# EAGLE schematic Board (EAGLE 9.2.2)
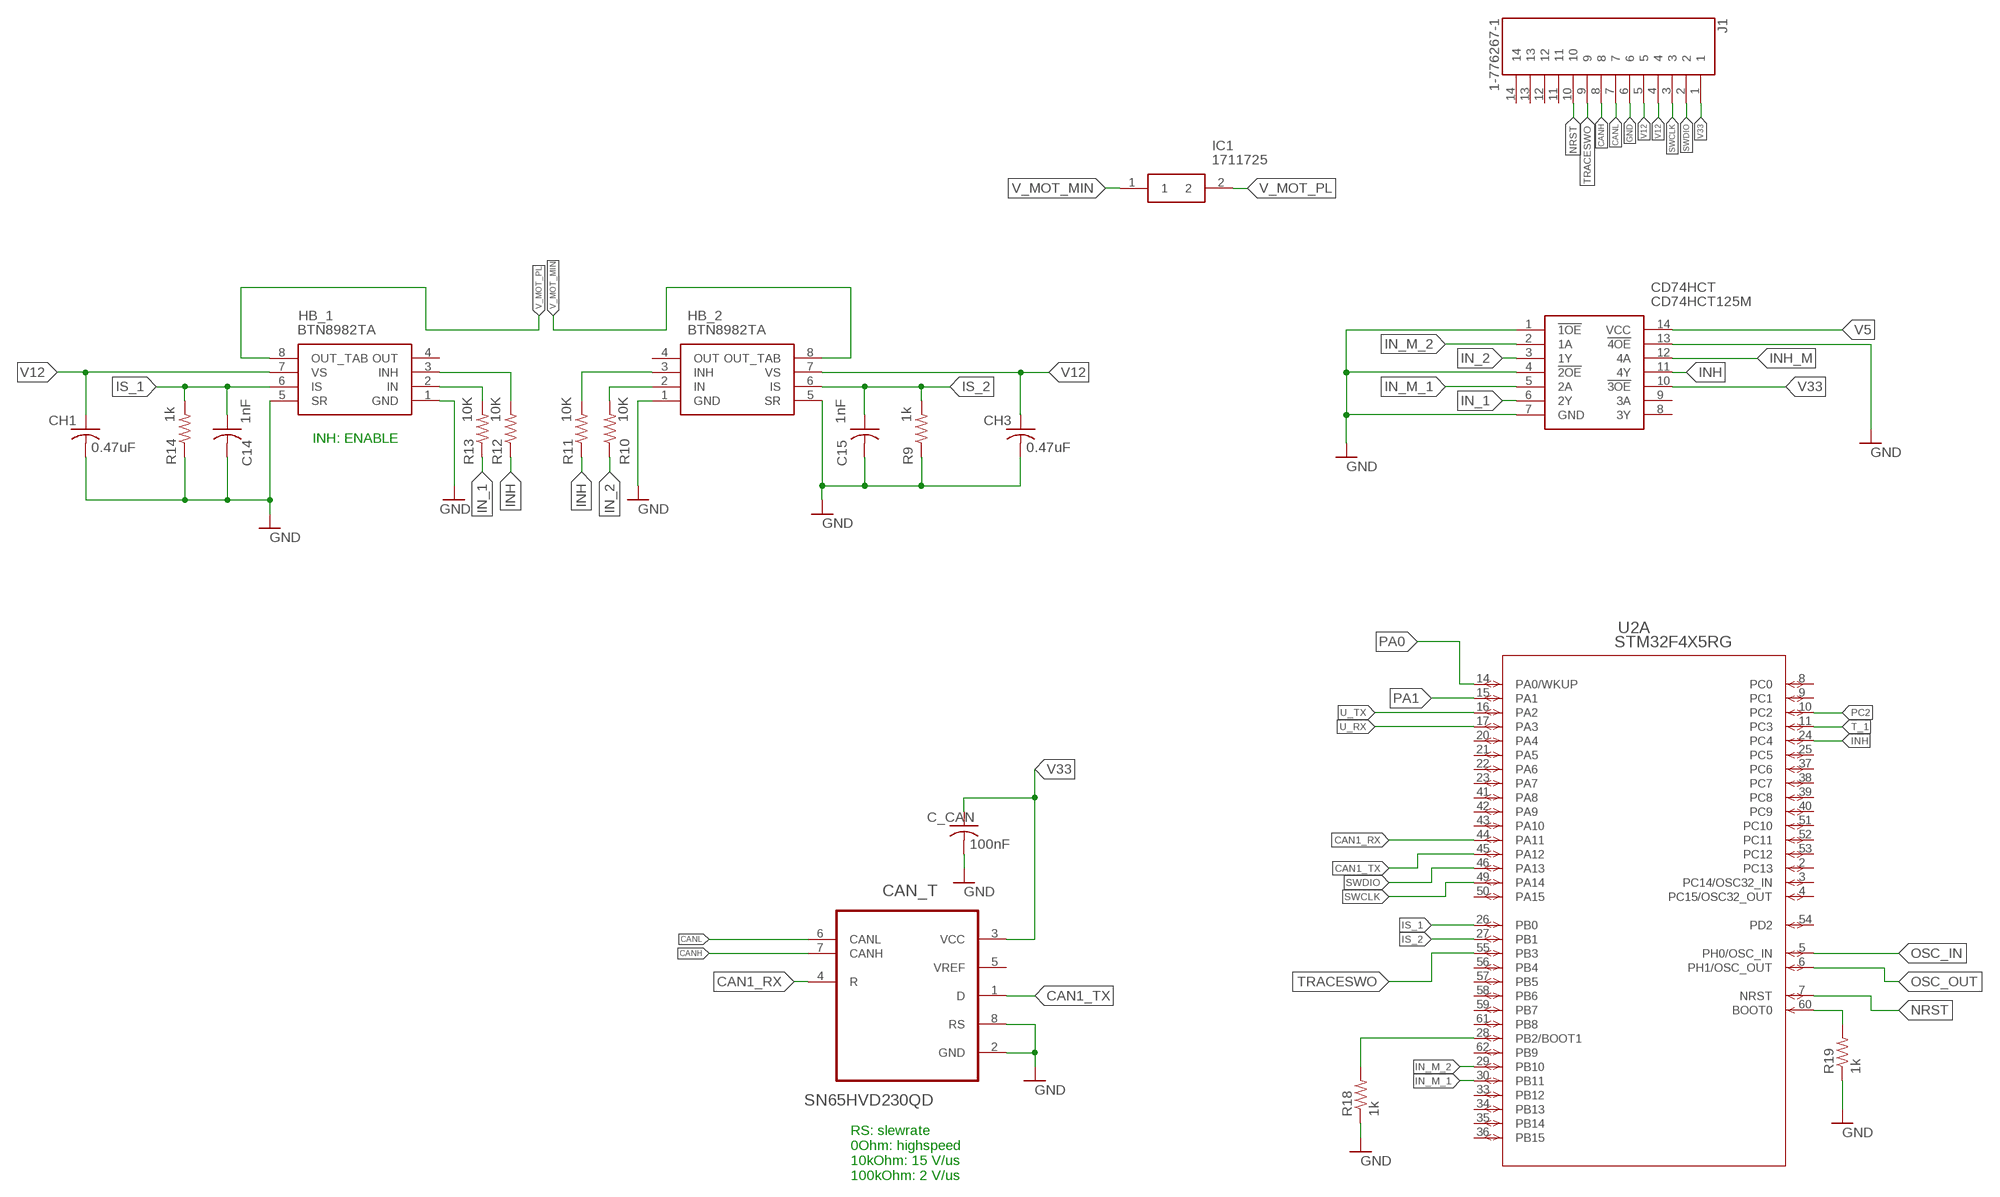
[diagram p0: schematic, sheet 1, part 1 of 2]
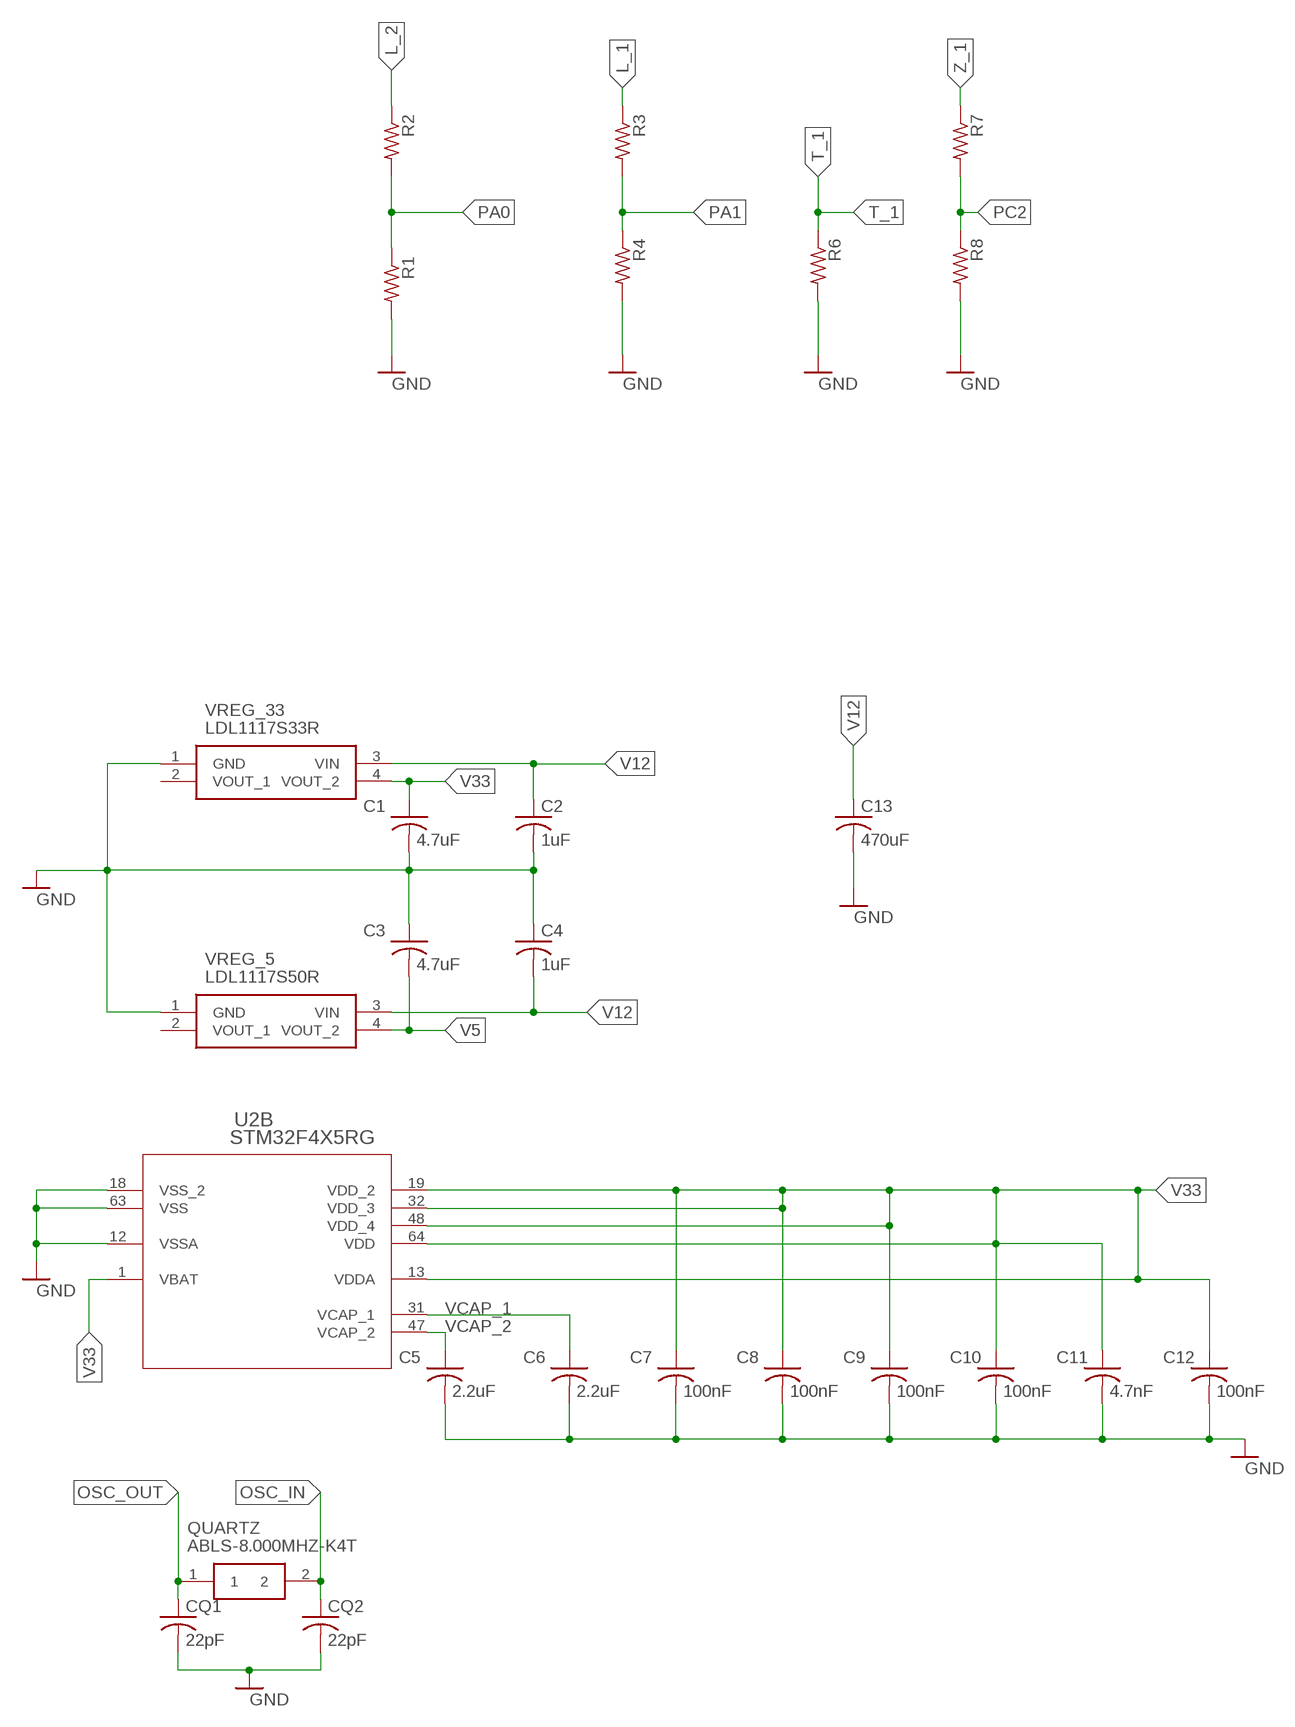
[diagram p1: schematic, sheet 1, part 2 of 2]

## Parts
C1  4.7uF  C-USC1206  [C1206]
C2  1uF  C-USC1206  [C1206]
C3  4.7uF  C-USC1206  [C1206]
C4  1uF  C-USC1206  [C1206]
C5  2.2uF  C-USC1206  [C1206]
C6  2.2uF  C-USC1206  [C1206]
C7  100nF  C-USC1206  [C1206]
C8  100nF  C-USC1206  [C1206]
C9  100nF  C-USC1206  [C1206]
C10  100nF  C-USC1206  [C1206]
C11  4.7nF  C-USC1206  [C1206]
C12  100nF  C-USC1206  [C1206]
C13  470uF  C-US050-075X075  [C050-075X075]
C14  1nF  C-USC1206  [C1206]
C15  1nF  C-USC1206  [C1206]
C_CAN  100nF  C-USC1206  [C1206]
CAN_T  SN65HVD230QD  [SOIC127P600X175-8N]
CD74HCT  CD74HCT125M  [SOIC127P600X175-14N]
CH1  0.47uF  C-USC1206  [C1206]
CH3  0.47uF  C-USC1206  [C1206]
CQ1  22pF  C-USC0805  [C0805]
CQ2  22pF  C-USC0805  [C0805]
HB_1  BTN8982TA  [TO127P1500X440-8N]
HB_2  BTN8982TA  [TO127P1500X440-8N]
IC1  1711725  [PHEONIX-5.08PITCH-2PIN]
J1  1-776267-1  [TE_1-776267-1]
QUARTZ  ABLS-8.000MHZ-K4T  [ABLS-12.000MHZ-B2]
R1  R-US_R1206  [R1206]
R2  R-US_R1206  [R1206]
R3  R-US_R1206  [R1206]
R4  R-US_R1206  [R1206]
R6  R-US_R1206  [R1206]
R7  R-US_R1206  [R1206]
R8  R-US_R1206  [R1206]
R9  1k  R-US_R1206  [R1206]
R10  10K  R-US_R1206  [R1206]
R11  10K  R-US_R1206  [R1206]
R12  10K  R-US_R1206  [R1206]
R13  10K  R-US_R1206  [R1206]
R14  1k  R-US_R1206  [R1206]
R18  1k  R-US_R1206  [R1206]
R19  1k  R-US_R1206  [R1206]
U2  STM32F4X5RG  [LQFP64-10X10MM]
VREG_5  LDL1117S50R  [SOT230P700X180-4N]
VREG_33  LDL1117S33R  [SOT230P700X180-4N]

## Nets
BOOT0: R19.2 U2.60(A:BOOT0)
BOOT1: R18.2 U2.28(A:PB2/BOOT1)
CAN1_RX: CAN_T.4(R) U2.44(A:PA11)
CAN1_TX: CAN_T.1(D) U2.45(A:PA12)
CANH: CAN_T.7(CANH) J1.8
CANL: CAN_T.6(CANL) J1.7
GND: C1.2 C2.2 C3.1 C4.1 C5.2 C6.2 C7.2 C8.2 C9.2 C10.2 C11.2 C12.2 C13.2 C14.2 C15.2 C_CAN.2 CAN_T.2(GND) CAN_T.8(RS) CD74HCT.1(!1OE) CD74HCT.4(!2OE) CD74HCT.7(GND) CD74HCT.13(!4OE) CH1.2 CH3.2 CQ1.2 CQ2.2 HB_1.1(GND) HB_1.5(SR) HB_2.1(GND) HB_2.5(SR) J1.6 R1.2 R4.2 R6.2 R8.2 R9.1 R14.1 R18.1 R19.1 U2.12(B:VSSA) U2.18(B:VSS_2) U2.63(B:VSS) VREG_5.1(GND) VREG_33.1(GND)
HB1_IN: HB_1.2(IN) R13.2
HB1_INH: HB_1.3(INH) R12.2
HB2_IN: HB_2.2(IN) R10.2
HB2_INH: HB_2.3(INH) R11.2
IN_1: CD74HCT.6(2Y) R13.1
IN_2: CD74HCT.3(1Y) R10.1
IN_M_1: CD74HCT.5(2A) U2.30(A:PB11)
IN_M_2: CD74HCT.2(1A) U2.29(A:PB10)
INH: CD74HCT.11(4Y) R11.1 R12.1 U2.24(A:PC4)
INH_M: CD74HCT.12(4A)
IS_1: C14.1 HB_1.6(IS) R14.2 U2.26(A:PB0)
IS_2: C15.1 HB_2.6(IS) R9.2 U2.27(A:PB1)
L_1: R3.1
L_2: R2.1
NRST: J1.10 U2.7(A:NRST)
OSC_IN: CQ2.1 QUARTZ.2 U2.5(A:PH0/OSC_IN)
OSC_OUT: CQ1.1 QUARTZ.1 U2.6(A:PH1/OSC_OUT)
PA0: R1.1 R2.2 U2.14(A:PA0/WKUP)
PA1: R3.2 R4.1 U2.15(A:PA1)
PC2: R7.2 R8.1 U2.10(A:PC2)
SWCLK: J1.3 U2.49(A:PA14)
SWDIO: J1.2 U2.46(A:PA13)
T_1: R6.1 U2.11(A:PC3)
TRACESWO: J1.9 U2.55(A:PB3)
U_RX: U2.17(A:PA3)
U_TX: U2.16(A:PA2)
V5: C3.2 CD74HCT.14(VCC) VREG_5.4(VOUT_2)
V12: C2.1 C4.2 C13.1 CH1.1 CH3.1 HB_1.7(VS) HB_2.7(VS) J1.4 J1.5 VREG_5.3(VIN) VREG_33.3(VIN)
V33: C1.1 C7.1 C8.1 C9.1 C10.1 C11.1 C12.1 C_CAN.1 CAN_T.3(VCC) CD74HCT.10(!3OE) J1.1 U2.1(B:VBAT) U2.13(B:VDDA) U2.19(B:VDD_2) U2.32(B:VDD_3) U2.48(B:VDD_4) U2.64(B:VDD) VREG_33.4(VOUT_2)
V_MOT_MIN: HB_2.8(OUT_TAB) IC1.1
V_MOT_PL: HB_1.8(OUT_TAB) IC1.2
VCAP_1: C6.1 U2.31(B:VCAP_1)
VCAP_2: C5.1 U2.47(B:VCAP_2)
Z_1: R7.1
Unconnected: CAN_T.5(VREF) CD74HCT.8(3Y) CD74HCT.9(3A) HB_1.4(OUT) HB_2.4(OUT) J1.11 J1.12 J1.13 J1.14 U2.2(A:PC13) U2.3(A:PC14/OSC32_IN) U2.4(A:PC15/OSC32_OUT) U2.8(A:PC0) U2.9(A:PC1) U2.20(A:PA4) U2.21(A:PA5) U2.22(A:PA6) U2.23(A:PA7) U2.25(A:PC5) U2.33(A:PB12) U2.34(A:PB13) U2.35(A:PB14) U2.36(A:PB15) U2.37(A:PC6) U2.38(A:PC7) U2.39(A:PC8) U2.40(A:PC9) U2.41(A:PA8) U2.42(A:PA9) U2.43(A:PA10) U2.50(A:PA15) U2.51(A:PC10) U2.52(A:PC11) U2.53(A:PC12) U2.54(A:PD2) U2.56(A:PB4) U2.57(A:PB5) U2.58(A:PB6) U2.59(A:PB7) U2.61(A:PB8) U2.62(A:PB9) VREG_5.2(VOUT_1) VREG_33.2(VOUT_1)

## Notes on the sheet
- INH: ENABLE
- RS: slewrate
  0Ohm: highspeed
  10kOhm: 15 V/us
  100kOhm: 2 V/us

## Library data of the parts
C1-C15 C_CAN CH1 CH3 CQ1 CQ2 = adafruit:C-US: CAPACITOR, American symbol
CAN_T = ADP_Components:SN65HVD230QD: 3.3-V CAN TRANSCEIVERS; MF: TEXAS INSTRUMENTS; MPN: SN65HVD230QD..; OC_FARNELL: 1648752; OC_NEWARK: 75C7746; PACKAGE: SOIC-8; SUPPLIER: Texas Instruments
CD74HCT = SamacSys_Parts:CD74HCT125M: High Speed CMOS Logic Quad Buffers with 3-State Outputs Source: Datasheet <http://www.ti.com/lit/ds/symlink/cd74hct125.pdf>; DESCRIPTION: High Speed CMOS Logic Quad Buffers with 3-State Outputs; HEIGHT: 1.75mm; MANUFACTURER_NAME: Texas Instruments; MANUFACTURER_PART_NUMBER: CD74HCT125M; MOUSER_PART_NUMBER: 595-CD74HCT125M
HB_1 HB_2 = SamacSys_Parts:BTN8982TA: New Infineon BTN8982TA Motor Driver,, 7-Pin TO-263-7-1 Source: Datasheet <http://www.mouser.com/datasheet/2/196/Infineon-BTN8982TA-DS-v01_00-EN-786008.pdf>; DESCRIPTION: New Infineon BTN8982TA Motor Driver,, 7-Pin TO-263-7-1; HEIGHT: 4.4mm; MANUFACTURER_NAME: Infineon; MANUFACTURER_PART_NUMBER: BTN8982TA; MOUSER_PART_NUMBER: 726-BTN8982TA
IC1 = SamacSys_Parts:1711725: Non-Fused Terminal Block Through Hole, 2 Way, Solder, Nylon, 250 V Source: Datasheet; DESCRIPTION: Non-Fused Terminal Block Through Hole, 2 Way, Solder, Nylon, 250 V; HEIGHT: mm; MANUFACTURER_NAME: Phoenix Contact; MANUFACTURER_PART_NUMBER: 1711725; MOUSER_PART_NUMBER: 651-1711725; MOUSER_PRICE-STOCK: https://www.mouser.com/Search/Refine.aspx?Keyword=651-1711725
J1 = 1-776267-1:1-776267-1: AMPSEAL 14 Position 4 mm Pitch Triple Row Wire to Board Right Angle Header; COMMENT: 1-776267-1; DESCRIPTION: AMPSEAL 14 Position 4 mm Pitch Triple Row Wire to Board Right Angle Header; DIGI-KEY_PART_NUMBER: A142413-ND; DIGI-KEY_PURCHASE_URL: https://www.digikey.com/product-detail/en/te-connectivity-amp-connectors/1-776267-1/A142413-ND/5428565?utm_source=snapeda&utm_medium=aggregator&utm_campaign=symbol; EU_ROHS_COMPLIANCE: Compliant; MF: TE Connectivity; MP: 1-776267-1; PACKAGE: None; TE_PURCHASE_URL: https://www.te.com/usa-en/product-1-776267-1.html?te_bu=Cor&te_type=disp&te_campaign=seda_glo_cor-seda-global-disp-prtnr-fy19-seda-model-bom-cta_sma-317_1&elqCampaignId=32493
QUARTZ = SamacSys_Parts:ABLS-8.000MHZ-K4T: ABRACON - ABLS-8.000MHZ-K4T - CRYSTAL, 8MHZ, 18PF, HC-49US Source: Datasheet <https://componentsearchengine.com/Datasheets/1/ABLS-8.000MHZ-K4T.pdf>; DESCRIPTION: ABRACON - ABLS-8.000MHZ-K4T - CRYSTAL, 8MHZ, 18PF, HC-49US; HEIGHT: mm; MANUFACTURER_NAME: ABRACON; MANUFACTURER_PART_NUMBER: ABLS-8.000MHZ-K4T; MF: ABRACON; MOUSER_PART_NUMBER: 815-ABLS-8.0MK4-T; MPN: ABLS-8.000MHZ-K4T; OC_FARNELL: 2467758
R1-R4 R6-R14 R18 R19 = adafruit:R-US_: RESISTOR, American symbol
U2 = ADP_Components:STM32F4X5RG; MANUFACTURER_PART_NUMBER: STM32F4X5RG; OC_FARNELL: unknown; VENDOR: STMicroelectronics
VREG_5 = SamacSys_Parts:LDL1117S50R: STMICROELECTRONICS - LDL1117S50R - LDO, FIXED, 5V, 1.2A, SOT-223-3 Source: Datasheet <http://www.mouser.com/datasheet/2/389/ldl1117-1156241.pdf>; DESCRIPTION: STMICROELECTRONICS - LDL1117S50R - LDO, FIXED, 5V, 1.2A, SOT-223-3; HEIGHT: 1.8mm; MANUFACTURER_NAME: STMicroelectronics; MANUFACTURER_PART_NUMBER: LDL1117S50R; MF: STMICROELECTRONICS; MOUSER_PART_NUMBER: 511-LDL1117S50R; MPN: LDL1117S50R; OC_FARNELL: 2729709
VREG_33 = SamacSys_Parts:LDL1117S33R: STMICROELECTRONICS - LDL1117S33R - LDO, FIXED, 3.3V, 1.2A, SOT-223-3 Source: Datasheet <http://www.mouser.com/datasheet/2/389/ldl1117-1156241.pdf>; DESCRIPTION: STMICROELECTRONICS - LDL1117S33R - LDO, FIXED, 3.3V, 1.2A, SOT-223-3; HEIGHT: 1.8mm; MANUFACTURER_NAME: STMicroelectronics; MANUFACTURER_PART_NUMBER: LDL1117S33R; MF: STMICROELECTRONICS; MOUSER_PART_NUMBER: 511-LDL1117S33R; MPN: LDL1117S33R; OC_FARNELL: 2729708

## Net classes
0 default: width 0.2 mm, drill 0.508 mm
1 V12: width 0.6 mm, drill 0.8 mm